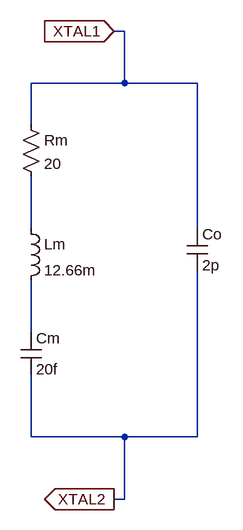
[diagram p0: schematic XTAL_10MHz_BVD.asc]
XTAL_10MHz_BVD.asc, the LTspice schematic file:
Version 4.1
SHEET 1 880 712
WIRE 304 -80 288 -80
WIRE 304 0 304 -80
WIRE 304 0 160 0
WIRE 416 0 304 0
WIRE 160 64 160 0
WIRE 160 224 160 144
WIRE 416 224 416 0
WIRE 160 384 160 304
WIRE 160 544 160 448
WIRE 304 544 160 544
WIRE 416 544 416 288
WIRE 416 544 304 544
WIRE 304 640 304 544
WIRE 304 640 288 640
FLAG 288 -80 XTAL1
IOPIN 288 -80 In
FLAG 288 640 XTAL2
IOPIN 288 640 Out
SYMBOL res 144 48 R0
SYMATTR InstName Rm
SYMATTR Value 20
SYMBOL ind 144 208 R0
SYMATTR InstName Lm
SYMATTR Value 12.66m
SYMBOL cap 144 384 R0
SYMATTR InstName Cm
SYMATTR Value 20f
SYMBOL cap 400 224 R0
SYMATTR InstName Co
SYMATTR Value 2p

The netlist it stands for:
* XTAL_10MHz_BVD.asc
Rm XTAL1 N001 20
Lm N001 N002 12.66m
Cm N002 XTAL2 20f
Co XTAL1 XTAL2 2p
.backanno
.end